# EasyEDA Pro project ProPrj_picoballoon-tracker-v2_2025-12-21.epro, board PCB7
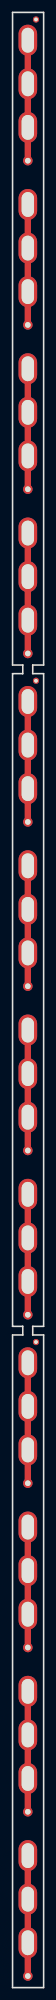
[diagram p3: board, top side]
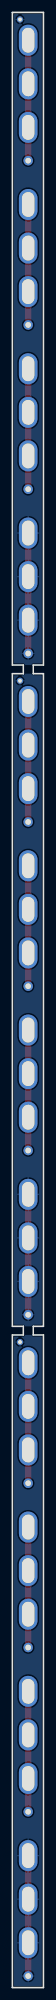
[diagram p4: board, bottom side, seen from below]

Outline 5.02 x 318.64 mm; copper layers: Top Layer, Bottom Layer. Coordinates in mm from the lower left corner of the outline.
Outline path: 0,318.64 0,213.36 1.65,213.36 1.65,211.96 0,211.96 0,106.68 1.65,106.68 1.65,105.28 0,105.28 0,0 5.02,0 5.02,105.28 3.26,105.28 3.26,106.68 5.02,106.68 5.02,211.96 3.26,211.96 3.26,213.36 5.02,213.36 5.02,318.64 0,318.64
Stack: Top Layer 0.035mm / Dielectric1 0.71mm FR4 er 4.5 / Bottom Layer 0.035mm

## Design rules (mm)
template: JLCPCB Capability(Two Layers Board)
spacing copperThickness1oz (default): track to track 0.102, other pairs 0.152 to 0.3
spacing copperThickness2oz: track to track 0.203, other pairs 0.152 to 0.3
track width copperThickness1oz (default): min 0.127, default 0.254, max 2.54
track width copperThickness2oz: min 0.203, default 0.254, max 2.54
differential pair differentialPair (default): width min 0.127, default 0.254, max 2.54; gap min 0.152, default 0.152
via viaSize (default): diameter min 0.5, default 0.61, max 10; hole min 0.3, default 0.305, max 6.3

## Placement (name value [footprint] x y rotation side)
NOREF  -  [Pad_e83]  2.47 161.54 90 top
NOREF#2  -  [Pad_e9]  2.47 74.29 90 top
NOREF#3  -  [Pad_e8]  2.47 47.79 90 top
NOREF#4  -  [Pad_e11]  2.47 67.27 90 top
NOREF#5  -  [Pad_e134]  2.47 215.22 90 top
NOREF#6  -  [Pad_e77]  2.47 166.92 90 top
NOREF#7  -  [Pad_e15]  2.47 93.77 90 top
NOREF#8  -  [Pad_e88]  2.47 120.94 90 top
NOREF#9  -  [Pad_e76]  2.47 188.04 90 top
NOREF#10  -  [Pad_e90]  3.79 210.82 0 top
NOREF#11  -  [Pad_e13]  2.47 28.36 90 top
NOREF#12  -  [Pad_e18]  2.47 40.76 90 top
NOREF#13  -  [Pad_e75]  2.47 140.42 90 top
NOREF#14  -  [Pad_e133]  2.47 287.65 90 top
NOREF#15  -  [Pad_e4]  2.47 33.74 90 top
NOREF#16  -  [Pad_e84]  2.47 135.04 90 top
NOREF#17  -  [Pad_e131]  2.47 300.1 90 top
NOREF#18  -  [Pad_e89]  2.47 147.44 90 top
NOREF#19  -  [Pad_e129]  2.47 294.72 90 top
NOREF#20  -  [Pad_e87]  2.47 127.97 90 top
NOREF#21  -  [Pad_e5]  2.47 81.36 90 top
NOREF#22  -  [Pad_e3]  2.47 7.24 90 top
NOREF#23  -  [Pad_e137]  2.47 241.72 90 top
NOREF#24  -  [Pad_e135]  2.47 280.62 90 top
NOREF#25  -  [Pad_e127]  2.47 220.6 90 top
NOREF#26  -  [Pad_e6]  2.47 86.74 90 top
NOREF#27  -  [Pad_e10]  2.47 1.86 90 top
NOREF#28  -  [Pad_e14]  2.47 100.8 90 top
NOREF#29  -  [Pad_e86]  2.47 200.45 90 top
NOREF#30  -  [Pad_e80]  2.47 180.97 90 top
NOREF#31  -  [Pad_e128]  2.47 247.1 90 top
NOREF#32  -  [Pad_e143]  3.79 317.5 0 top
NOREF#33  -  [Pad_e85]  2.47 207.48 90 top
NOREF#34  -  [Pad_e141]  2.47 227.62 90 top
NOREF#35  -  [Pad_e132]  2.47 261.15 90 top
NOREF#36  -  [Pad_e7]  2.47 60.24 90 top
NOREF#37  -  [Pad_e79]  2.47 154.47 90 top
NOREF#38  -  [Pad_e136]  2.47 268.22 90 top
NOREF#39  -  [Pad_e130]  2.47 273.6 90 top
NOREF#40  -  [Pad_e74]  2.47 113.92 90 top
NOREF#41  -  [Pad_e78]  2.47 193.42 90 top
NOREF#42  -  [Pad_e82]  2.47 173.94 90 top
NOREF#43  -  [Pad_e81]  2.47 108.54 90 top
NOREF#44  -  [Pad_e142]  2.47 254.12 90 top
NOREF#45  -  [Pad_e139]  2.47 307.13 90 top
NOREF#46  -  [Pad_e12]  2.47 54.86 90 top
NOREF#47  -  [Pad_e19]  3.79 104.14 0 top
NOREF#48  -  [Pad_e17]  2.47 14.26 90 top
NOREF#49  -  [Pad_e138]  2.47 314.16 90 top
NOREF#50  -  [Pad_e16]  2.47 21.29 90 top
NOREF#51  -  [Pad_e140]  2.47 234.65 90 top

## Footprints (pads in the part's own frame, mm; a bottom-side part is the same pattern mirrored in y, then rotated)
Pad_e3
  oval 5x3 hole 4x2: 1(0,0)
Pad_e4
  oval 5x3 hole 4x2: 1(0,0)
Pad_e5
  round 1.524 hole 0.914: 1(0,0)
Pad_e6
  oval 5x3 hole 4x2: 1(0,0)
Pad_e7
  oval 5x3 hole 4x2: 1(0,0)
Pad_e8
  oval 5x3 hole 4x2: 1(0,0)
Pad_e9
  oval 5x3 hole 4x2: 1(0,0)
Pad_e10
  round 1.524 hole 0.914: 1(0,0)
Pad_e11
  oval 5x3 hole 4x2: 1(0,0)
Pad_e12
  round 1.524 hole 0.914: 1(0,0)
Pad_e13
  round 1.524 hole 0.914: 1(0,0)
Pad_e14
  oval 5x3 hole 4x2: 1(0,0)
Pad_e15
  oval 5x3 hole 4x2: 1(0,0)
Pad_e16
  oval 5x3 hole 4x2: 1(0,0)
Pad_e17
  oval 5x3 hole 4x2: 1(0,0)
Pad_e18
  oval 5x3 hole 4x2: 1(0,0)
Pad_e19
  round 1 hole 0.6: 1(0,0)
Pad_e74
  oval 5x3 hole 4x2: 1(0,0)
Pad_e75
  oval 5x3 hole 4x2: 1(0,0)
Pad_e76
  round 1.524 hole 0.914: 1(0,0)
Pad_e77
  oval 5x3 hole 4x2: 1(0,0)
Pad_e78
  oval 5x3 hole 4x2: 1(0,0)
Pad_e79
  oval 5x3 hole 4x2: 1(0,0)
Pad_e80
  oval 5x3 hole 4x2: 1(0,0)
Pad_e81
  round 1.524 hole 0.914: 1(0,0)
Pad_e82
  oval 5x3 hole 4x2: 1(0,0)
Pad_e83
  round 1.524 hole 0.914: 1(0,0)
Pad_e84
  round 1.524 hole 0.914: 1(0,0)
Pad_e85
  oval 5x3 hole 4x2: 1(0,0)
Pad_e86
  oval 5x3 hole 4x2: 1(0,0)
Pad_e87
  oval 5x3 hole 4x2: 1(0,0)
Pad_e88
  oval 5x3 hole 4x2: 1(0,0)
Pad_e89
  oval 5x3 hole 4x2: 1(0,0)
Pad_e90
  round 1 hole 0.6: 1(0,0)
Pad_e127
  oval 5x3 hole 4x2: 1(0,0)
Pad_e128
  oval 5x3 hole 4x2: 1(0,0)
Pad_e129
  round 1.524 hole 0.914: 1(0,0)
Pad_e130
  oval 5x3 hole 4x2: 1(0,0)
Pad_e131
  oval 5x3 hole 4x2: 1(0,0)
Pad_e132
  oval 5x3 hole 4x2: 1(0,0)
Pad_e133
  oval 5x3 hole 4x2: 1(0,0)
Pad_e134
  round 1.524 hole 0.914: 1(0,0)
Pad_e135
  oval 5x3 hole 4x2: 1(0,0)
Pad_e136
  round 1.524 hole 0.914: 1(0,0)
Pad_e137
  round 1.524 hole 0.914: 1(0,0)
Pad_e138
  oval 5x3 hole 4x2: 1(0,0)
Pad_e139
  oval 5x3 hole 4x2: 1(0,0)
Pad_e140
  oval 5x3 hole 4x2: 1(0,0)
Pad_e141
  oval 5x3 hole 4x2: 1(0,0)
Pad_e142
  oval 5x3 hole 4x2: 1(0,0)
Pad_e143
  round 1 hole 0.6: 1(0,0)

## Nets
SLR1: NOREF#5.1 NOREF#8.1 NOREF#10.1 NOREF#20.1 NOREF#22.1 NOREF#25.1 NOREF#27.1 NOREF#32.1 NOREF#34.1 NOREF#40.1 NOREF#43.1 NOREF#47.1 NOREF#48.1 NOREF#50.1 NOREF#51.1
SLR2: NOREF#3.1 NOREF#11.1 NOREF#12.1 NOREF#13.1 NOREF#15.1 NOREF#16.1 NOREF#18.1 NOREF#23.1 NOREF#31.1 NOREF#35.1 NOREF#37.1 NOREF#44.1
SLR3: NOREF.1 NOREF#2.1 NOREF#4.1 NOREF#6.1 NOREF#14.1 NOREF#24.1 NOREF#30.1 NOREF#36.1 NOREF#38.1 NOREF#39.1 NOREF#42.1 NOREF#46.1
SLR4: NOREF#7.1 NOREF#9.1 NOREF#17.1 NOREF#19.1 NOREF#21.1 NOREF#26.1 NOREF#28.1 NOREF#29.1 NOREF#33.1 NOREF#41.1 NOREF#45.1 NOREF#49.1

## Routing (per net, layer and track width the routed paths; a pad name or vN(x,y) marks a point on that pad's centre or on a via; arc(x,y) is an arc through that point)
SLR1: length 58.3
  Top Layer w1.016: NOREF#27.1 NOREF#22.1 NOREF#48.1 NOREF#50.1 ; NOREF#20.1 NOREF#8.1 NOREF#40.1 NOREF#43.1 ; NOREF#51.1 NOREF#34.1 NOREF#25.1 NOREF#5.1
SLR2: length 58.3
  Top Layer w1.016: NOREF#35.1 NOREF#44.1 NOREF#31.1 NOREF#23.1 ; NOREF#11.1 NOREF#15.1 NOREF#12.1 NOREF#3.1 ; NOREF#37.1 NOREF#18.1 NOREF#13.1 NOREF#16.1
SLR3: length 58.3
  Top Layer w1.016: NOREF#14.1 NOREF#24.1 NOREF#39.1 NOREF#38.1 ; NOREF.1 NOREF#6.1 NOREF#42.1 NOREF#30.1 ; NOREF#2.1 NOREF#4.1 NOREF#36.1 NOREF#46.1
SLR4: length 58.3
  Top Layer w1.016: NOREF#28.1 NOREF#7.1 NOREF#26.1 NOREF#21.1 ; NOREF#49.1 NOREF#45.1 NOREF#17.1 NOREF#19.1 ; NOREF#33.1 NOREF#29.1 NOREF#41.1 NOREF#9.1

## Copper pours and planes (outline as drawn; the poured copper is in the pictures)
SLR1 on Bottom Layer: 0,105.28 5.02,105.28 5.02,0 0,0
SLR1 on Bottom Layer: 0,318.64 5.02,318.64 5.02,213.36 0,213.36
SLR1 on Bottom Layer: 0,211.96 5.02,211.96 5.02,106.68 0,106.68
